# Altium schematic sheet Main_CPU.SchDoc
size A3; DrawnBy: R.R.Sorial; SheetNumber: 1; SheetTotal: 5
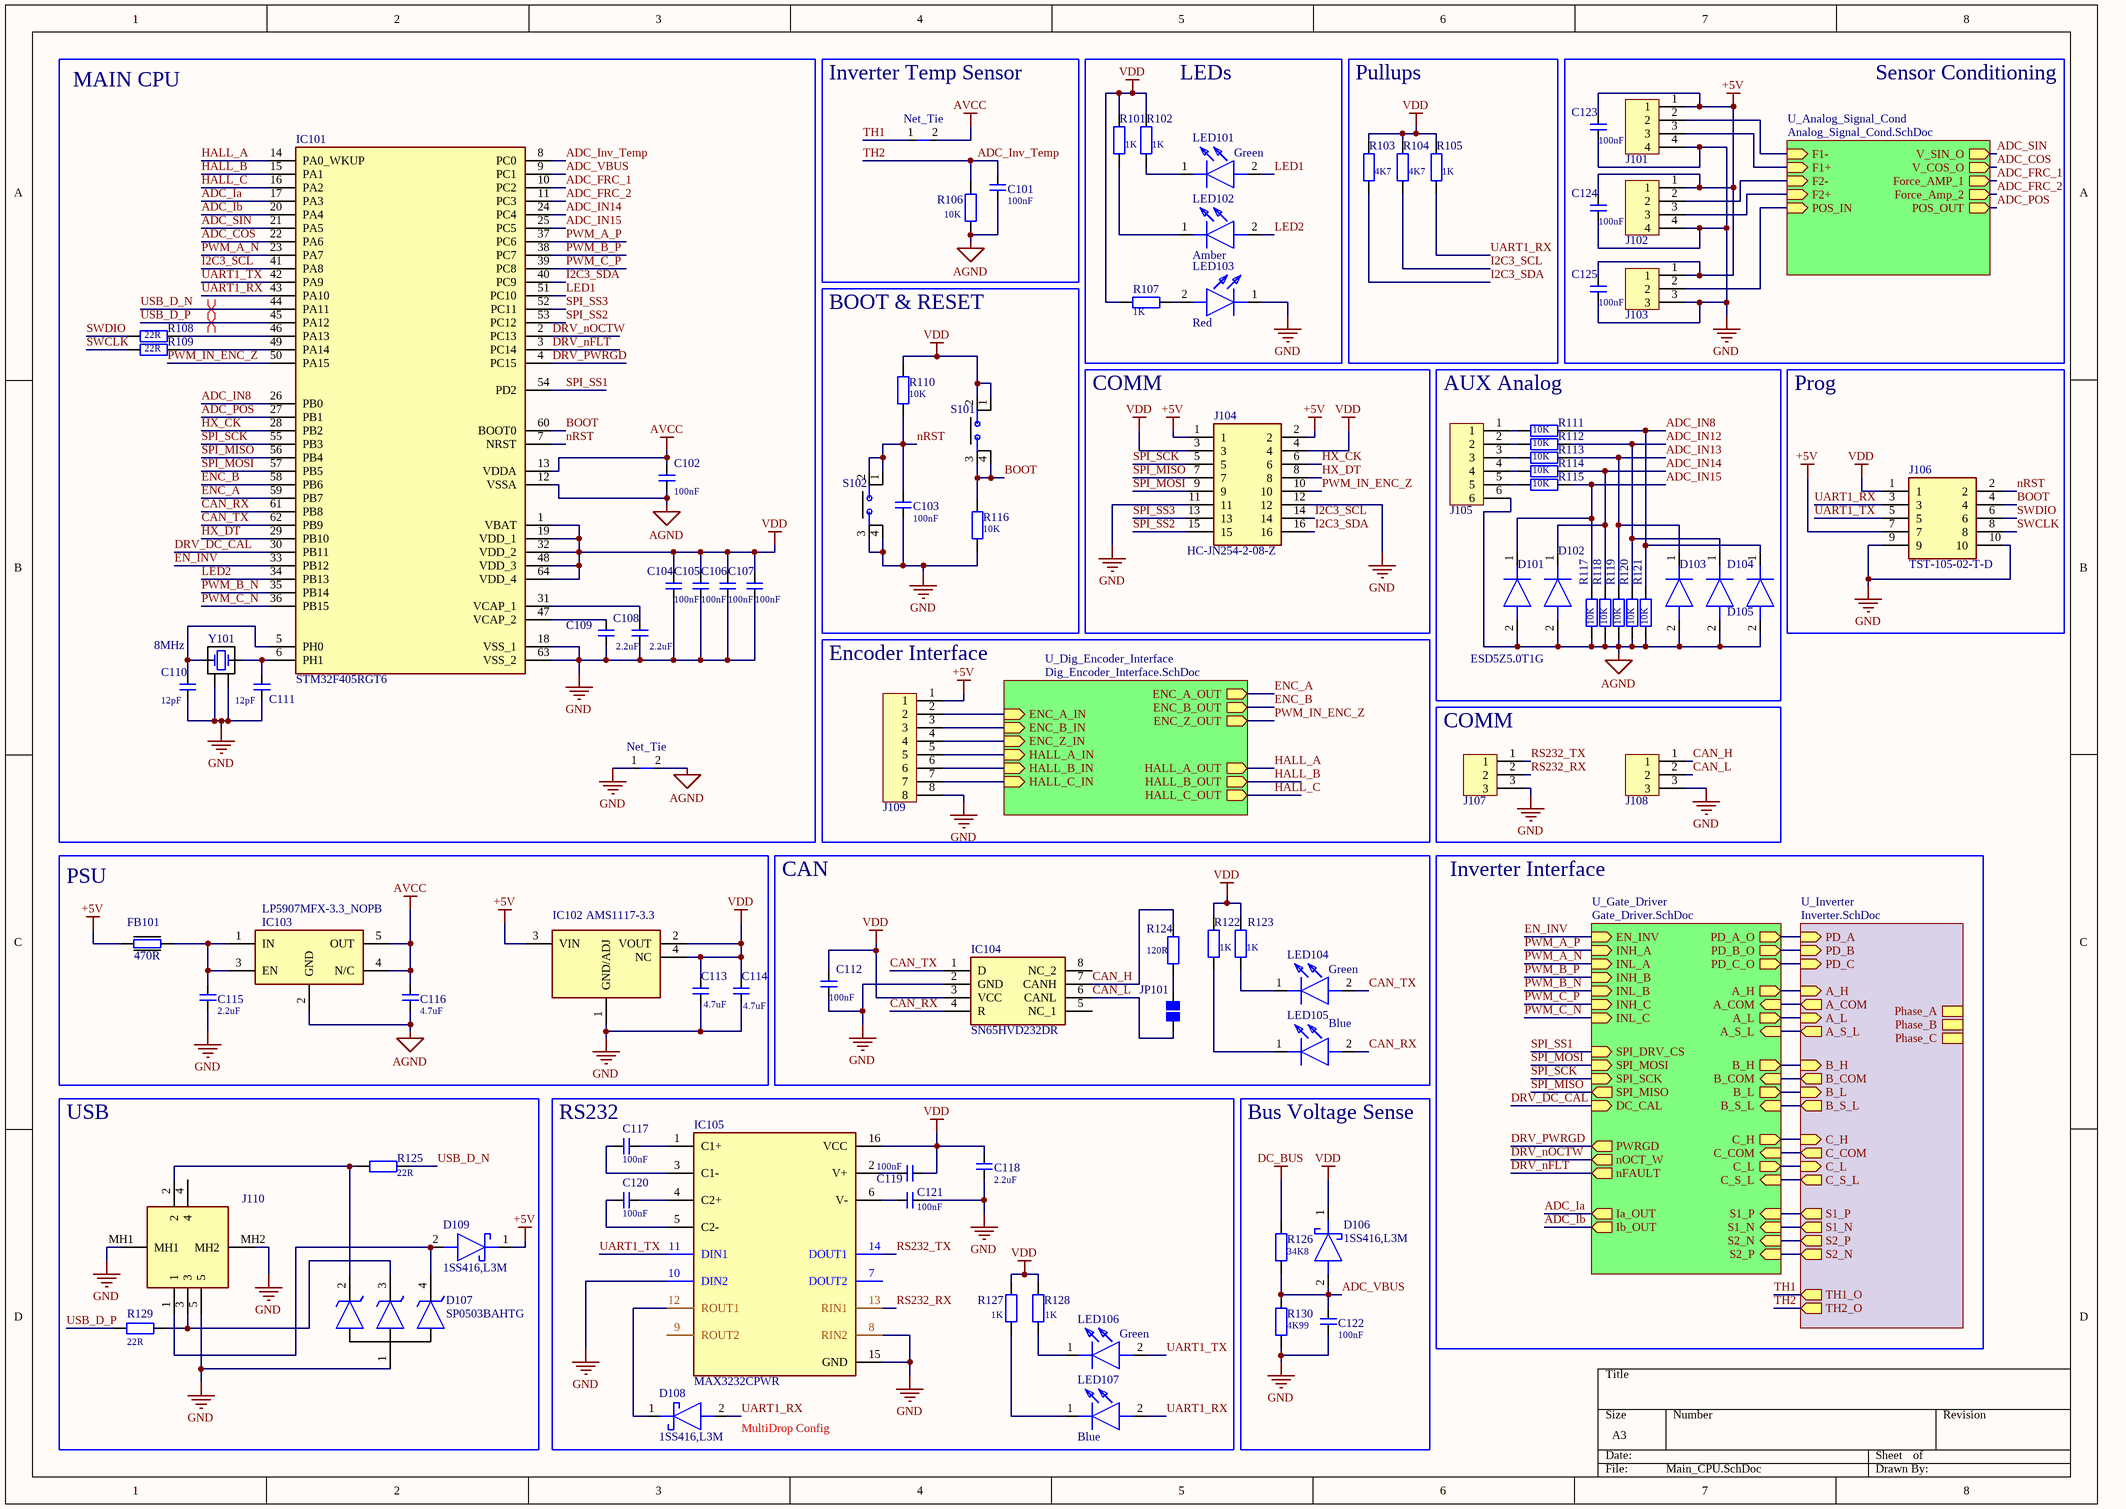
[diagram p0: Main_CPU.SchDoc]

## Parts
C101  value 100nF  [CAPC1005X06N]  (hidden comment: Cap)
C102  value 100nF  [CAPC1005X06N]  (hidden comment: Cap)
C103  value 100nF  [CAPC1005X06N]  (hidden comment: Cap)
C104  value 100nF  [CAPC1005X06N]  (hidden comment: Cap)
C105  value 100nF  [CAPC1005X06N]  (hidden comment: Cap)
C106  value 100nF  [CAPC1005X06N]  (hidden comment: Cap)
C107  value 100nF  [CAPC1005X06N]  (hidden comment: Cap)
C108  value 2.2uF  [CAPC1005X06N]  (hidden comment: Cap)
C109  value 2.2uF  [CAPC1005X06N]  (hidden comment: Cap)
C110  value 12pF  [CAPC1005X06N]  (hidden comment: Cap)
C111  value 12pF  [CAPC1005X06N]  (hidden comment: Cap)
C112  value 100nF  [CAPC1005X06N]  (hidden comment: Cap)
C113  value 4.7uF  [CAPC3225X17N]  (hidden comment: Cap)
C114  value 4.7uF  [CAPC3225X17N]  (hidden comment: Cap)
C115  value 2.2uF  [CAPC1005X06N]  (hidden comment: Cap)
C116  value 4.7uF  [CAPC3225X17N]  (hidden comment: Cap)
C117  value 100nF  [CAPC1005X06N]  (hidden comment: Cap)
C118  value 2.2uF  [CAPC1005X06N]  (hidden comment: Cap)
C119  value 100nF  [CAPC1005X06N]  (hidden comment: Cap)
C120  value 100nF  [CAPC1005X06N]  (hidden comment: Cap)
C121  value 100nF  [CAPC1005X06N]  (hidden comment: Cap)
C122  value 100nF  [CAPC1005X06N]  (hidden comment: Cap)
C123  value 100nF  [CAPC1005X06N]  (hidden comment: Cap)
C124  value 100nF  [CAPC1005X06N]  (hidden comment: Cap)
C125  value 100nF  [CAPC1005X06N]  (hidden comment: Cap)
D101  ESD5Z5.0T1G  [SODFL1608X70N]
D102  ESD5Z5.0T1G  [SODFL1608X70N]  (value not drawn)
D103  ESD5Z5.0T1G  [SODFL1608X70N]  (value not drawn)
D104  ESD5Z5.0T1G  [SODFL1608X70N]  (value not drawn)
D105  ESD5Z5.0T1G  [SODFL1608X70N]  (value not drawn)
D106  1SS416,L3M  [SODFL1006X45N]
D107  SP0503BAHTG  [SP0503BAHTG]
D108  1SS416,L3M  [SODFL1006X45N]
D109  1SS416,L3M  [SODFL1006X45N]
FB101  value 470R  [BLM18SP221SN1B]  (hidden comment: 470 OHM)
IC101  STM32F405RGT6  [QFP50P1200X1200X160-64N]
IC102  AMS1117-3.3  [SOT229P700X180-4N]
IC103  LP5907MFX-3.3_NOPB  [SOT95P280X145-5N]
IC104  SN65HVD232DR  [SOIC127P600X175-8N]
IC105  MAX3232CPWR  [SOP65P640X120-16N]
J101  XH2_54_4p  [XH2.54-4P]  (value not drawn)
J102  XH2_54_4p  [XH2.54-4P]  (value not drawn)
J103  XH2_54_3p  [XH2.54-3P]  (value not drawn)
J104  MPN: HC-JN254-2-08-Z  [SHDR16W64P254_2X8_2794X927X940P]  (hidden comment: TST-108-02-T-D)
J105  PCB_Conn_6P  [PCB_CONN_6]  (value not drawn)  (no BOM)
J106  TST-105-02-T-D  [TST-105-XX-Y-D]
J107  XH2_54_3p  [XH2.54-3P]  (value not drawn)
J108  XH2_54_3p  [XH2.54-3P]  (value not drawn)
J109  PCB_Conn_8p  [PCB_CONN_8]  (value not drawn)  (no BOM)
J110  10119313-301TLF  [10119313301TLF]  (value not drawn)
JP101  Jumper  [Jumper]  (value not drawn)  (no BOM)
LED101  Green  [LEDC1608X80N]
LED102  Amber  [LEDC1608X80N]
LED103  Red  [LEDC1608X80N]
LED104  Green  [LEDC1608X80N]
LED105  Blue  [LEDC1608X80N]
LED106  Green  [LEDC1608X80N]
LED107  Blue  [LEDC1608X80N]
NT101  Net_Tie  [Net_Tie_SMD]  (net tie, no BOM)
NT102  Net_Tie  [Net_Tie_SMD]  (net tie, no BOM)
R101  value 1K  [RESC1005X04N]  (hidden comment: R)
R102  value 1K  [RESC1005X04N]  (hidden comment: R)
R103  value 4K7  [RESC1005X04N]  (hidden comment: R)
R104  value 4K7  [RESC1005X04N]  (hidden comment: R)
R105  value 1K  [RESC1005X04N]  (hidden comment: R)
R106  value 10K  [RESC1005X04N]  (hidden comment: R)
R107  value 1K  [RESC1005X04N]  (hidden comment: R)
R108  value 22R  [RESC1005X04N]  (hidden comment: R)
R109  value 22R  [RESC1005X04N]  (hidden comment: R)
R110  value 10K  [RESC1005X04N]  (hidden comment: R)
R111  value 10K  [RESC1005X04N]  (hidden comment: R)
R112  value 10K  [RESC1005X04N]  (hidden comment: R)
R113  value 10K  [RESC1005X04N]  (hidden comment: R)
R114  value 10K  [RESC1005X04N]  (hidden comment: R)
R115  value 10K  [RESC1005X04N]  (hidden comment: R)
R116  value 10K  [RESC1005X04N]  (hidden comment: R)
R117  value 10K  [RESC1005X04N]  (hidden comment: R)
R118  value 10K  [RESC1005X04N]  (hidden comment: R)
R119  value 10K  [RESC1005X04N]  (hidden comment: R)
R120  value 10K  [RESC1005X04N]  (hidden comment: R)
R121  value 10K  [RESC1005X04N]  (hidden comment: R)
R122  value 1K  [RESC1005X04N]  (hidden comment: R)
R123  value 1K  [RESC1005X04N]  (hidden comment: R)
R124  value 120R  [RESC3216X06N]  (hidden comment: R)
R125  value 22R  [RESC1005X04N]  (hidden comment: R)
R126  value 34K8  [RESC1005X04N]  (hidden comment: R)
R127  value 1K  [RESC1005X04N]  (hidden comment: R)
R128  value 1K  [RESC1005X04N]  (hidden comment: R)
R129  value 22R  [RESC1005X04N]  (hidden comment: R)
R130  value 4K99  [RESC1005X04N]  (hidden comment: R)
S101  TS18-5-25-SL-260-SMT-TR  [TS18525SL260SMTTR]  (value not drawn)
S102  TS18-5-25-SL-260-SMT-TR  [TS18525SL260SMTTR]  (value not drawn)
Y101  value 8MHz  [830105863709]

## Blocks framed on the sheet
MAIN CPU: C102 C104-C111 IC101 NT101 R108 R109 Y101
Inverter Temp Sensor: C101 NT102 R106
LEDs: LED101-LED103 R101 R102 R107
Pullups: R103-R105
Sensor Conditioning: C123-C125 J101-J103
BOOT & RESET: C103 R110 R116 S101 S102
COMM: J104
AUX Analog: D101-D105 J105 R111-R115 R117-R121
Prog: J106
Encoder Interface: J109
COMM: J107 J108
PSU: C113-C116 FB101 IC102 IC103
CAN: C112 IC104 JP101 LED104 LED105 R122-R124
USB: D107 D109 J110 R125 R129
RS232: C117-C121 D108 IC105 LED106 LED107 R127 R128
Bus Voltage Sense: C122 D106 R126 R130

## Sub-sheets
U_Analog_Signal_Cond = Analog_Signal_Cond.SchDoc: V_SIN_O (out), V_COS_O (out), Force_AMP_1 (out), Force_Amp_2 (out), POS_OUT (out), F1- (in), F1+ (in), F2- (in), F2+ (in), POS_IN (in)
U_Dig_Encoder_Interface = Dig_Encoder_Interface.SchDoc: ENC_A_OUT (out), ENC_B_OUT (out), ENC_Z_OUT (out), HALL_A_OUT (out), HALL_B_OUT (out), HALL_C_OUT (out), ENC_A_IN (in), ENC_B_IN (in), ENC_Z_IN (in), HALL_A_IN (in), HALL_B_IN (in), HALL_C_IN (in)
U_Gate_Driver = Gate_Driver.SchDoc: EN_INV (in), INH_A (in), INL_A (in), INH_B (in), INL_B (in), INH_C (in), INL_C (in), SPI_DRV_CS (in), SPI_MISO (out), SPI_MOSI (in), SPI_SCK (in), DC_CAL (in), nOCT_W (out), nFAULT (out), S1_N (in), S1_P (in), S2_N (in), S2_P (in), A_H (out), A_L (out), A_COM (in), A_S_L (in), B_H (out), B_L (out), B_COM (in), B_S_L (in), C_H (out), C_L (out), C_COM (in), C_S_L (in), PWRGD (out), Ia_OUT (out), Ib_OUT (out), PD_A_O (out), PD_B_O (out), PD_C_O (out)
U_Inverter = Inverter.SchDoc: Phase_A, Phase_B, Phase_C, S1_P (out), S1_N (out), A_H (in), A_COM (out), A_L (in), A_S_L (out), S2_P (out), S2_N (out), B_H (in), B_COM (out), B_L (in), B_S_L (out), TH1_O (out), TH2_O (out), C_S_L (out), C_H (in), C_COM (out), C_L (in), PD_C (in), PD_A (in), PD_B (in)

## Nets
+5V: C123.2 C124.2 C125.2 D109.1(K) FB101.1 IC102.3(VIN) J101.1 J102.1 J103.1 J104.1 J104.2 J106.7 J109.1
AGND: C101.1 C102.1 C116.1 D101.2(A) D102.2(A) D103.2(A) D104.2(A) D105.2(A) IC101.12(VSSA) IC103.2(GND) J105.6 NT101.2 R106.1 R117.2 R118.2 R119.2 R120.2 R121.2
AVCC: C102.2 C116.2 IC101.13(VDDA) IC103.4(N/C) IC103.5(OUT) NT102.2
DC_BUS: R126.1
GND: C103.1 C104.1 C105.1 C106.1 C107.1 C108.1 C109.1 C110.1 C111.1 C112.1 C113.1 C114.1 C115.1 C118.1 C121.1 C122.1 C123.1 C124.1 C125.1 D107.1(A) IC101.18(VSS_1) IC101.63(VSS_2) IC102.1(GND/ADJ) IC104.2(GND) IC105.8(RIN2) IC105.10(DIN2) IC105.15(GND) J101.4 J102.4 J103.3 J104.11 J104.12 J106.9 J106.10 J107.3 J108.3 J109.8 J110.5 J110.MH1 J110.MH2 LED103.1(K) NT101.1 R116.1 R130.2 S102.3(COM_1) S102.4(COM_2) Y101.2(GND_&_LID_1) Y101.4(GND_&_LID_2)
VDD: C104.2 C105.2 C106.2 C107.2 C112.2 C113.2 C114.2 C118.2 C119.1 D106.1(K) IC101.1(VBAT) IC101.19(VDD_1) IC101.32(VDD_2) IC101.48(VDD_3) IC101.64(VDD_4) IC102.2(VOUT) IC102.4(NC) IC104.3(VCC) IC105.16(VCC) J104.3 J104.4 J106.1 R101.1 R102.1 R103.1 R104.1 R105.1 R107.2 R110.2 R122.2 R123.2 R127.2 R128.2 S101.1(NO_1) S101.2(NO_2)
ADC_COS: IC101.22(PA6) ; sheet U_Analog_Signal_Cond/V_COS_O
ADC_FRC_1: IC101.10(PC2) ; sheet U_Analog_Signal_Cond/Force_AMP_1
ADC_FRC_2: IC101.11(PC3) ; sheet U_Analog_Signal_Cond/Force_Amp_2
ADC_Ia: IC101.17(PA3) ; sheet U_Gate_Driver/Ia_OUT
ADC_Ib: IC101.20(PA4) ; sheet U_Gate_Driver/Ib_OUT
ADC_IN8: D105.1(K) IC101.26(PB0) R111.1 R121.1
ADC_IN12: D104.1(K) R112.1 R120.1
ADC_IN13: D103.1(K) R113.1 R119.1
ADC_IN14: D102.1(K) IC101.24(PC4) R114.1 R118.1
ADC_IN15: D101.1(K) IC101.25(PC5) R115.1 R117.1
ADC_Inv_Temp: C101.2 IC101.8(PC0) R106.2 ; sheet U_Inverter/TH2_O  [also labelled TH2]
ADC_POS: IC101.27(PB1) ; sheet U_Analog_Signal_Cond/POS_OUT
ADC_SIN: IC101.21(PA5) ; sheet U_Analog_Signal_Cond/V_SIN_O
ADC_VBUS: C122.2 D106.2(A) IC101.9(PC1) R126.2 R130.1
BOOT: IC101.60(BOOT0) J106.4 R116.2 S101.3(COM_1) S101.4(COM_2)
CAN_H: IC104.7(CANH) J108.1 R124.2
CAN_L: IC104.6(CANL) J108.2 JP101.1
CAN_RX: IC101.61(PB8) IC104.4(R) LED105.2(A)
CAN_TX: IC101.62(PB9) IC104.1(D) LED104.2(A)
DRV_DC_CAL: IC101.30(PB11) ; sheet U_Gate_Driver/DC_CAL
DRV_nFLT: IC101.3(PC14) ; sheet U_Gate_Driver/nFAULT
DRV_nOCTW: IC101.2(PC13) ; sheet U_Gate_Driver/nOCT_W
DRV_PWRGD: IC101.4(PC15) ; sheet U_Gate_Driver/PWRGD
EN_INV: IC101.33(PB12) ; sheet U_Gate_Driver/EN_INV
ENC_A: IC101.59(PB7) ; sheet U_Dig_Encoder_Interface/ENC_A_OUT
ENC_B: IC101.58(PB6) ; sheet U_Dig_Encoder_Interface/ENC_B_OUT
HALL_A: IC101.14(PA0_WKUP) ; sheet U_Dig_Encoder_Interface/HALL_A_OUT
HALL_B: IC101.15(PA1) ; sheet U_Dig_Encoder_Interface/HALL_B_OUT
HALL_C: IC101.16(PA2) ; sheet U_Dig_Encoder_Interface/HALL_C_OUT
HX_CK: IC101.28(PB2) J104.6
HX_DT: IC101.29(PB10) J104.8
I2C3_SCL: IC101.41(PA8) J104.14 R104.2
I2C3_SDA: IC101.40(PC9) J104.16 R103.2
LED1: IC101.51(PC10) LED101.2(A)
LED2: IC101.34(PB13) LED102.2(A)
nRST: C103.2 IC101.7(NRST) J106.2 R110.1 S102.1(NO_1) S102.2(NO_2)
PWM_A_N: IC101.23(PA7) ; sheet U_Gate_Driver/INL_A
PWM_A_P: IC101.37(PC6) ; sheet U_Gate_Driver/INH_A
PWM_B_N: IC101.35(PB14) ; sheet U_Gate_Driver/INL_B
PWM_B_P: IC101.38(PC7) ; sheet U_Gate_Driver/INH_B
PWM_C_N: IC101.36(PB15) ; sheet U_Gate_Driver/INL_C
PWM_C_P: IC101.39(PC8) ; sheet U_Gate_Driver/INH_C
PWM_IN_ENC_Z: IC101.50(PA15) J104.10 ; sheet U_Dig_Encoder_Interface/ENC_Z_OUT
RS232_RX: IC105.13(RIN1) J107.2
RS232_TX: IC105.14(DOUT1) J107.1
SPI_MISO: IC101.56(PB4) J104.7 ; sheet U_Gate_Driver/SPI_MISO
SPI_MOSI: IC101.57(PB5) J104.9 ; sheet U_Gate_Driver/SPI_MOSI
SPI_SCK: IC101.55(PB3) J104.5 ; sheet U_Gate_Driver/SPI_SCK
SPI_SS1: IC101.54(PD2) ; sheet U_Gate_Driver/SPI_DRV_CS
SPI_SS2: IC101.53(PC12) J104.15
SPI_SS3: IC101.52(PC11) J104.13
SWCLK: J106.8 R109.2
SWDIO: J106.6 R108.2
TH1: NT102.1 ; sheet U_Inverter/TH1_O
UART1_RX: D108.2(A) IC101.43(PA10) J106.3 LED107.2(A) R105.2
UART1_TX: IC101.42(PA9) IC105.11(DIN1) J106.5 LED106.2(A)
USB_D_N: IC101.44(PA11) R125.1
USB_D_P: IC101.45(PA12) R129.2
NetC108_2: C108.2 IC101.31(VCAP_1)
NetC109_2: C109.2 IC101.47(VCAP_2)
NetC110_2: C110.2 IC101.5(PH0) Y101.1(CRYSTAL__1)
NetC111_2: C111.2 IC101.6(PH1) Y101.3(CRYSTAL__2)
NetC115_2: C115.2 FB101.2 IC103.1(IN) IC103.3(EN)
NetC117_1: C117.1 IC105.1(C1+)
NetC117_2: C117.2 IC105.3(C1-)
NetC119_2: C119.2 IC105.2(V+)
NetC120_1: C120.1 IC105.4(C2+)
NetC120_2: C120.2 IC105.5(C2-)
NetC121_2: C121.2 IC105.6(V-)
NetD107_2: D107.2(K) J110.2 R125.2
NetD107_3: D107.3(K) J110.3 R129.1
NetD107_4: D107.4(K) D109.2(A) J110.1
NetD108_1: D108.1(K) IC105.12(ROUT1)
NetIC101_46: IC101.46(PA13) R108.1
NetIC101_49: IC101.49(PA14) R109.1
NetJ101_2: J101.2 ; sheet U_Analog_Signal_Cond/F1-
NetJ101_3: J101.3 ; sheet U_Analog_Signal_Cond/F1+
NetJ102_2: J102.2 ; sheet U_Analog_Signal_Cond/F2-
NetJ102_3: J102.3 ; sheet U_Analog_Signal_Cond/F2+
NetJ103_2: J103.2 ; sheet U_Analog_Signal_Cond/POS_IN
NetJ105_1: J105.1 R111.2
NetJ105_2: J105.2 R112.2
NetJ105_3: J105.3 R113.2
NetJ105_4: J105.4 R114.2
NetJ105_5: J105.5 R115.2
NetJ109_2: J109.2 ; sheet U_Dig_Encoder_Interface/ENC_A_IN
NetJ109_3: J109.3 ; sheet U_Dig_Encoder_Interface/ENC_B_IN
NetJ109_4: J109.4 ; sheet U_Dig_Encoder_Interface/ENC_Z_IN
NetJ109_5: J109.5 ; sheet U_Dig_Encoder_Interface/HALL_A_IN
NetJ109_6: J109.6 ; sheet U_Dig_Encoder_Interface/HALL_B_IN
NetJ109_7: J109.7 ; sheet U_Dig_Encoder_Interface/HALL_C_IN
NetJP101_2: JP101.2 R124.1
NetLED101_1: LED101.1(K) R102.2
NetLED102_1: LED102.1(K) R101.2
NetLED103_2: LED103.2(A) R107.1
NetLED104_1: LED104.1(K) R123.1
NetLED105_1: LED105.1(K) R122.1
NetLED106_1: LED106.1(K) R128.1
NetLED107_1: LED107.1(K) R127.1
(unnamed): sheet U_Gate_Driver/S1_N, sheet U_Inverter/S1_N
(unnamed): sheet U_Gate_Driver/S1_P, sheet U_Inverter/S1_P
(unnamed): sheet U_Gate_Driver/S2_N, sheet U_Inverter/S2_P
(unnamed): sheet U_Gate_Driver/S2_P, sheet U_Inverter/S2_N
(unnamed): sheet U_Gate_Driver/A_H, sheet U_Inverter/A_H
(unnamed): sheet U_Gate_Driver/A_L, sheet U_Inverter/A_L
(unnamed): sheet U_Gate_Driver/A_COM, sheet U_Inverter/A_COM
(unnamed): sheet U_Gate_Driver/A_S_L, sheet U_Inverter/A_S_L
(unnamed): sheet U_Gate_Driver/B_H, sheet U_Inverter/B_H
(unnamed): sheet U_Gate_Driver/B_L, sheet U_Inverter/B_L
(unnamed): sheet U_Gate_Driver/B_COM, sheet U_Inverter/B_COM
(unnamed): sheet U_Gate_Driver/B_S_L, sheet U_Inverter/B_S_L
(unnamed): sheet U_Gate_Driver/C_H, sheet U_Inverter/C_H
(unnamed): sheet U_Gate_Driver/C_L, sheet U_Inverter/C_L
(unnamed): sheet U_Gate_Driver/C_COM, sheet U_Inverter/C_COM
(unnamed): sheet U_Gate_Driver/C_S_L, sheet U_Inverter/C_S_L
(unnamed): sheet U_Gate_Driver/PD_A_O, sheet U_Inverter/PD_A
(unnamed): sheet U_Gate_Driver/PD_B_O, sheet U_Inverter/PD_B
(unnamed): sheet U_Gate_Driver/PD_C_O, sheet U_Inverter/PD_C

Not connected (* = marked no-connect by the designer): IC104 5(NC_1) 8(NC_2); IC105 7(DOUT2) 9(ROUT2); J110 4

## Layout directives
differential pair: USB_D_N, USB_D_P

## Notes on the sheet
- Inverter Interface
- (near D108) MultiDrop Config

## Library data of the parts
C101-C107 C112 C117 C119-C125 = Cap: Capacitor; MPN: GCM155R71H104KE02D; Link: https://jlcpcb.com/partdetail/MurataElectronics-GCM155R71H104KE02D/C85858; Price: 0.0031
C108 C109 C115 C118 = Cap: Capacitor; MPN: GRM155Z71A225KE44D; Link: https://jlcpcb.com/partdetail/3478404-GRM155Z71A225KE44D/C2999759; Price: 0.0332
C110 C111 = Cap: Capacitor; MPN: GRM1555C1H120JA01D; Link: https://jlcpcb.com/partdetail/MurataElectronics-GRM1555C1H120JA01D/C76948; Price: 0.0028
C113 C114 C116 = Cap: Capacitor; MPN: CC1210KKX7R8BB475; Link: https://www.lcsc.com/product-detail/Multilayer-Ceramic-Capacitors-MLCC-SMD-SMT_YAGEO-CC1210KKX7R8BB475_C2980104.html; Price: 0.1519
D101 D105 = ESD5Z5.0T1G: Diode; Manufacturer_Name: onsemi; Datasheet Link: http://www.onsemi.com/pub/Collateral/ESD5Z2.5T1-D.PDF; Height: 0.7mm; Mouser Part Number: 863-ESD5Z5.0T1G; Mouser Price/Stock: https://www.mouser.co.uk/ProductDetail/onsemi/ESD5Z5.0T1G?qs=OSf9jACorvYw3fDx1S8P6A%3D%3D; Arrow Part Number: ESD5Z5.0T1G; Arrow Price/Stock: https://www.arrow.com/en/products/esd5z5.0t1g/on-semiconductor?utm_currency=USD&region=nac; MPN: ESD5Z5.0T1G
  D101: ComponentLink1Description: New link; ComponentLink1URL: *; link: https://www.lcsc.com/product-detail/ESD-and-Surge-Protection-TVS-ESD_BORN-ESD5Z5-0T1G_C343989.html?s_z=n_ESD5Z5.0T1G
  D105: limk: https://www.lcsc.com/product-detail/ESD-and-Surge-Protection-TVS-ESD_BORN-ESD5Z5-0T1G_C343989.html?s_z=n_ESD5Z5.0T1G
D102-D104 = ESD5Z5.0T1G: Diode; Manufacturer_Name: onsemi; MPN: 863-ESD5Z5.0T1G; Datasheet Link: http://www.onsemi.com/pub/Collateral/ESD5Z2.5T1-D.PDF; Height: 0.7mm; Mouser Price/Stock: https://www.mouser.co.uk/ProductDetail/onsemi/ESD5Z5.0T1G?qs=OSf9jACorvYw3fDx1S8P6A%3D%3D; Arrow Part Number: ESD5Z5.0T1G; Arrow Price/Stock: https://www.arrow.com/en/products/esd5z5.0t1g/on-semiconductor?utm_currency=USD&region=nac; Manufacturer_Part_Number: ESD5Z5.0T1G; link: https://www.lcsc.com/product-detail/ESD-and-Surge-Protection-TVS-ESD_BORN-ESD5Z5-0T1G_C343989.html?s_z=n_ESD5Z5.0T1G
D106 D108 D109 = 1SS416,L3M: Schottky Diode; Manufacturer_Name: Toshiba; MPN: 1SS416,L3M(B; Datasheet Link: http://toshiba.semicon-storage.com/info/docget.jsp?did=344&prodName=1SS416; Height: 0.45mm; Mouser Part Number: 757-1SS416L3M; Mouser Price/Stock: https://www.mouser.co.uk/ProductDetail/Toshiba/1SS416L3M?qs=G9o9YCnxvoYU%252BWabcXJZJg%3D%3D; Arrow Part Number: 1SS416,L3M; Arrow Price/Stock: https://www.arrow.com/en/products/1ss416l3m/toshiba?region=nac; Link: https://www.lcsc.com/product-detail/Schottky-Diodes_TOSHIBA-1SS416-L3M-B_C2943683.html; Price: 0.0251
D107 = SP0503BAHTG: TVS Diode (Uni-directional); Manufacturer_Name: LITTELFUSE; Datasheet Link: https://nl.mouser.com/datasheet/2/240/Littelfuse_TVS_Diode_Array_SP05_Datasheet.pdf-777043.pdf; Height: 1.22mm; MPN: SP0503BAHTG; Mouser Part Number: 576-SP0503BAHTG; Mouser Price/Stock: https://www.mouser.co.uk/ProductDetail/Littelfuse/SP0503BAHTG?qs=uD%2FdkN7XIa0NTYXwHdELYA%3D%3D; Arrow Part Number: SP0503BAHTG; Arrow Price/Stock: https://www.arrow.com/en/products/sp0503bahtg/littelfuse?region=nac; Link: https://www.lcsc.com/product-detail/ESD-and-Surge-Protection-TVS-ESD_Littelfuse-SP0503BAHTG_C7074.html; Price: 0.1508
FB101 = BLM18KG471SN1D: Ferrite Bead; Manufacturer_Name: Murata Electronics; Datasheet Link: http://www.murata.com/~/media/webrenewal/support/library/catalog/products/emc/emifil/c31e.ashx?la=en-gb; Height: 0.95mm; MPN: BLM18KG471SN1D; Mouser Part Number: 81-BLM18KG471SN1D; Mouser Price/Stock: https://www.mouser.co.uk/ProductDetail/Murata-Electronics/BLM18KG471SN1D?qs=rvfpa0%252BU10NIg0zs9veElg%3D%3D; Arrow Part Number: BLM18KG471SN1D; Arrow Price/Stock: https://www.arrow.com/en/products/blm18kg471sn1d/murata-manufacturing?region=europe; Link: https://www.lcsc.com/product-detail/Ferrite-Beads_Murata-Electronics-BLM18KG471SN1D_C413961.html
IC101 = STM32F405RGT6: Integrated Circuit; Manufacturer_Name: STMicroelectronics; Datasheet Link: http://www.st.com/web/en/resource/technical/document/datasheet/DM00037051.pdf; Height: 1.6mm; MPN: STM32F405RGT6; Mouser Part Number: 511-STM32F405RGT6; Mouser Price/Stock: https://www.mouser.co.uk/ProductDetail/STMicroelectronics/STM32F405RGT6?qs=Z8%252BeY1k3TIKgj7QWsYGpQw%3D%3D; Arrow Part Number: STM32F405RGT6; Arrow Price/Stock: https://www.arrow.com/en/products/stm32f405rgt6/stmicroelectronics?utm_currency=USD&region=nac; Link: https://www.lcsc.com/product-detail/Microcontrollers-MCU-MPU-SOC_STMicroelectronics-STM32F405RGT6_C15742.html; Price: 2.6733
IC102 = AMS1117-3.3: Integrated Circuit; Manufacturer_Name: Advanced; Datasheet Link: https://datasheet.datasheetarchive.com/originals/distributors/Datasheets-28/DSA-550594.pdf; Height: 1.8mm; MPN: AMS1117-3.3; Link: https://www.lcsc.com/product-detail/Voltage-Regulators-Linear-Low-Drop-Out-LDO-Regulators_Advanced-Monolithic-Systems-AMS1117-3-3_C6186.html; Price: 0.1342
IC103 = LP5907MFX-3.3_NOPB: Integrated Circuit; Manufacturer_Name: Texas Instruments; MPN: LP5907MFX-3.3/NOPB; Datasheet Link: https://datasheet.datasheetarchive.com/originals/distributors/Datasheets-SFU2/DSASFU100037200.pdf; Height: 1.45mm; Mouser Part Number: 595-LP5907MFX-3.3NPB; Mouser Price/Stock: https://www.mouser.co.uk/ProductDetail/Texas-Instruments/LP5907MFX-3.3-NOPB?qs=biyDIajrTn6NhrJCoL%2FdSQ%3D%3D; Arrow Part Number: LP5907MFX-3.3/NOPB; Arrow Price/Stock: https://www.arrow.com/en/products/lp5907mfx-3.3nopb/texas-instruments?utm_currency=USD&region=nac; Link: https://www.lcsc.com/product-detail/Voltage-Regulators-Linear-Low-Drop-Out-LDO-Regulators_Texas-Instruments-LP5907MFX-3-3-NOPB_C80670.html; Price: 0.1083
IC104 = SN65HVD232DR: Integrated Circuit; Manufacturer_Name: Texas Instruments; Datasheet Link: http://www.ti.com/lit/gpn/sn65hvd232; Height: 1.75mm; MPN: SN65HVD232DR; Mouser Price/Stock: https://www.mouser.co.uk/ProductDetail/Texas-Instruments/SN65HVD232DR?qs=QViXGNcIEAtY%252BrViRMr46w%3D%3D; Arrow Part Number: SN65HVD232DR; Arrow Price/Stock: https://www.arrow.com/en/products/sn65hvd232dr/texas-instruments?region=nac; Link: https://www.lcsc.com/product-detail/CAN-Transceivers_Texas-Instruments-SN65HVD232DR_C30530.html; Price: 0.4813
IC105 = MAX3232CPWR: Integrated Circuit; Manufacturer_Name: Texas Instruments; Datasheet Link: http://www.ti.com/lit/gpn/max3232; Height: 1.2mm; MPN: MAX3232CPWR; Mouser Price/Stock: https://www.mouser.co.uk/ProductDetail/Texas-Instruments/MAX3232CPWR?qs=bkMXpVdiF40tDMAEI%2F4vWA%3D%3D; Arrow Part Number: MAX3232CPWR; Arrow Price/Stock: https://www.arrow.com/en/products/max3232cpwr/texas-instruments?region=nac; Link: https://www.lcsc.com/product-detail/RS232-ICs_Texas-Instruments-MAX3232CPWR_C428620.html; Price: 0.4166
J101 J102 = XH2_54_4p: MPN: BX-XH2.54-4PZZ; Link: https://www.lcsc.com/product-detail/Wire-To-Board-Connector_Bossie-BX-XH2-54-4PZZ_C18077835.html; Price: 0.0185
J103 J107 J108 = XH2_54_3p: MPN: ZX-XH2.54-3PZZ; Link: https://www.lcsc.com/product-detail/Wire-To-Board-Connector_Megastar-ZX-XH2-54-3PZZ_C7429633.html; Price: 0.0073
J104 = TST-108-02-T-D: Connector; Mouser Part Number: 200-TST10802TD; Mouser Price/Stock: https://www.mouser.co.uk/ProductDetail/Samtec/TST-108-02-T-D?qs=rU5fayqh%252BE1iZn2yp3BQ2w%3D%3D; Arrow Part Number: TST-108-02-T-D; Arrow Price/Stock: https://www.arrow.com/en/products/tst-108-02-t-d/samtec?region=nac; Link: https://www.lcsc.com/product-detail/IDC-Connectors_HCTL-HC-JN254-2-08-Z_C5372867.html; Price: 0.0987
J106 = TST-105-02-T-D: Connector; Manufacturer_Name: SAMTEC; MPN: ZX-IDC2.54-2-5PZZ; Datasheet Link: http://suddendocs.samtec.com/prints/tst-1xx-xx-x-x-xx-xx-mkt.pdf; Mouser Part Number: 200-TST10502TD; Mouser Price/Stock: https://www.mouser.co.uk/ProductDetail/Samtec/TST-105-02-T-D?qs=rU5fayqh%252BE1w4XXP0IOe8w%3D%3D; Arrow Part Number: TST-105-02-T-D; Arrow Price/Stock: https://www.arrow.com/en/products/tst-105-02-t-d/samtec?region=nac; Link: https://www.lcsc.com/product-detail/IDC-Connectors_Megastar-ZX-IDC2-54-2-5PZZ_C7501191.html?s_z=n_IDC%20Connector; Price: 0.1126
J110 = 10119313-301TLF: Connector; Manufacturer_Name: Amphenol; MPN: HX MINI5P T; Datasheet Link: https://cdn.amphenol-cs.com/media/wysiwyg/files/drawing/10119313.pdf; Height: 9.7mm; Mouser Part Number: 649-10119313-301TLF; Mouser Price/Stock: https://www.mouser.co.uk/ProductDetail/Amphenol-FCI/10119313-301TLF?qs=QcFhgjUTvvrAeUuachPUXg%3D%3D; link: https://www.lcsc.com/product-detail/USB-Connectors_hanxia-HX-MINI5P-T_C19189146.html
LED101 LED104 LED106 = 150060SS75000: LED; Manufacturer_Name: Wurth Elektronik; MPN: XL-1608UGC-04; Height: 0.8mm; Mouser Part Number: 710-150060SS75000; Mouser Price/Stock: https://www.mouser.co.uk/ProductDetail/Wurth-Elektronik/150060SS75000?qs=LlUlMxKIyB0oQaxwspeTEA%3D%3D; Price: 0.0041; Link: https://www.lcsc.com/product-detail/LED-Indication-Discrete_XINGLIGHT-XL-1608UGC-04_C965804.html
LED102 = 150060SS75000: LED; Manufacturer_Name: Wurth Elektronik; MPN: 19-217UYOC/S3112/TR8; Height: 0.8mm; Mouser Part Number: 710-150060SS75000; Mouser Price/Stock: https://www.mouser.co.uk/ProductDetail/Wurth-Elektronik/150060SS75000?qs=LlUlMxKIyB0oQaxwspeTEA%3D%3D; Price: 0.0247; Link: https://www.lcsc.com/product-detail/LED-Indication-Discrete_Everlight-Elec-19-217UYOC-S3112-TR8_C264473.html
LED103 = 150060SS75000: LED; Manufacturer_Name: Wurth Elektronik; MPN: XL-1608SURC-06; Height: 0.8mm; Mouser Part Number: 710-150060SS75000; Mouser Price/Stock: https://www.mouser.co.uk/ProductDetail/Wurth-Elektronik/150060SS75000?qs=LlUlMxKIyB0oQaxwspeTEA%3D%3D; Price: 0.003; Link: https://www.lcsc.com/product-detail/LED-Indication-Discrete_XINGLIGHT-XL-1608SURC-06_C965799.html
LED105 LED107 = 150060SS75000: LED; Manufacturer_Name: Wurth Elektronik; MPN: XL-1608UBC-04; Height: 0.8mm; Mouser Part Number: 710-150060SS75000; Mouser Price/Stock: https://www.mouser.co.uk/ProductDetail/Wurth-Elektronik/150060SS75000?qs=LlUlMxKIyB0oQaxwspeTEA%3D%3D; Price: 0.0033; Link: https://www.lcsc.com/product-detail/LED-Indication-Discrete_XINGLIGHT-XL-1608UBC-04_C965807.html
NT101 NT102 = Net_Tie: Net Tie
R101 R102 R105 R107 R122 R123 R127 R128 = R: Resistor; MPN: RC0402FR-071KL; Link: RC0402FR-071KL; Price: 0.0006
R103 R104 = R: Resistor; MPN: RC0402FR-074K7L; Link: https://jlcpcb.com/partdetail/Yageo-RC0402FR074K7L/C105871; Price: 0.0006
R106 R110-R121 = R: Resistor; MPN: RC0402FR-0710KL; Link: https://jlcpcb.com/partdetail/Yageo-RC0402FR0710KL/C60490; Price: 0.0005
R108 R109 R125 R129 = R: Resistor; MPN: RC0402FR-0722RL; Link: https://jlcpcb.com/partdetail/Yageo-RC0402FR0722RL/C114765; Price: 0.0006
R124 = R: Resistor; MPN: RC1206FR-07120RL; Link: https://www.lcsc.com/product-detail/Chip-Resistor-Surface-Mount_YAGEO-RC1206FR-07120RL_C114928.html; Price: 0.0036
R126 = R: Resistor; MPN: RC0402FR-0734K8L; Link: https://jlcpcb.com/partdetail/Yageo-RC0402FR0734K8L/C327350; Price: 0.0006
R130 = R: Resistor; MPN: RC0402FR-074K99L; Link: https://jlcpcb.com/partdetail/Yageo-RC0402FR074K99L/C137965; Price: 0.0006
S101 S102 = TS18-5-25-SL-260-SMT-TR: Switch; Manufacturer_Name: Same Sky; MPN: GT-TC084B-H015-L5; Datasheet Link: https://www.sameskydevices.com/product/resource/supplyframepdf/ts18.pdf; Height: 2.7mm; Mouser Part Number: 179-TS18525SL260SMTT; Mouser Price/Stock: https://www.mouser.co.uk/ProductDetail/Same-Sky/TS18-5-25-SL-260-SMT-TR?qs=tlsG%2FOw5FFh0yS4gYnfcwg%3D%3D; Link: https://www.lcsc.com/product-detail/Tactile-Switches_G-Switch-GT-TC084B-H015-L5_C778173.html; Price: 0.049
Y101 = XTAL_3225: Crystal or Oscillator; Manufacturer_Name: Wurth Elektronik; MPN: XL2EL89COI-111YLC-8M; Datasheet Link: https://www.we-online.com/catalog/datasheet/830105863709.pdf; Height: 0.8mm; Mouser Part Number: 710-830105863709; Mouser Price/Stock: https://www.mouser.co.uk/ProductDetail/Wurth-Elektronik/830105863709?qs=hd1VzrDQEGgXVxZIC%252BUALw%3D%3D; Link: https://www.lcsc.com/product-detail/Crystals_YXC-Crystal-Oscillators-XL2EL89COI-111YLC-8M_C2973805.html; Price: 0.115